# EAGLE design yamaguchi (EAGLE 7.4.0)
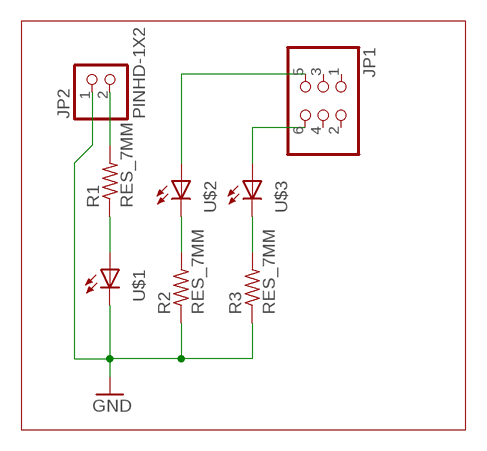
[diagram p0: schematic, sheet 1]

## Parts
JP1  PINHD-2X3  [2X03]
JP2  PINHD-1X2  [1X02]
R1  RES_7MM  [0204/7]
R2  RES_7MM  [0204/7]
R3  RES_7MM  [0204/7]
U$1  LED1206  [1206]
U$2  LED1206  [1206]
U$3  LED1206  [1206]

## Nets
GND: JP2.1 R2.1 R3.1 U$1.2(C)
N$1: JP2.2 R1.2
N$2: R1.1 U$1.1(A)
N$4: R2.2 U$2.2(C)
N$5: R3.2 U$3.2(C)
N$6: JP1.6 U$3.1(A)
N$7: JP1.5 U$2.1(A)
Unconnected: JP1.1 JP1.2 JP1.3 JP1.4

## Library data of the parts
JP1 = 01_EasyAccessLib:PINHD-2X3: PIN HEADER
JP2 = Yamaguchi:PINHD-1X2
R1-R3 = Yamaguchi:RES_7MM
U$1-U$3 = 01_EasyAccessLib:LED

## Board
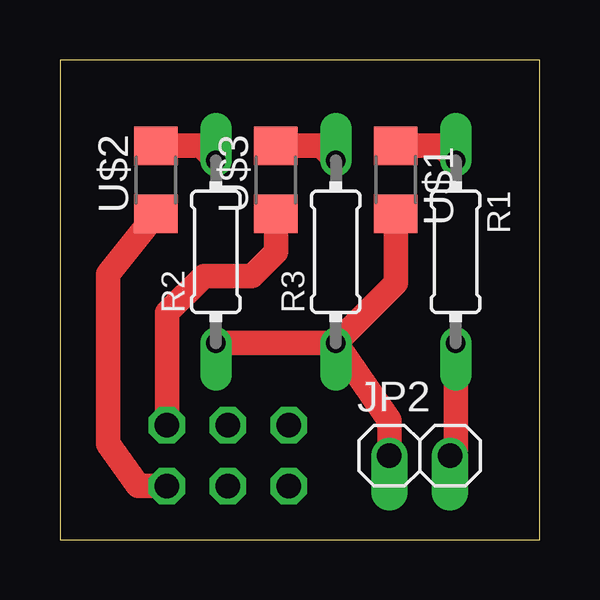
[diagram p1: board, top side]
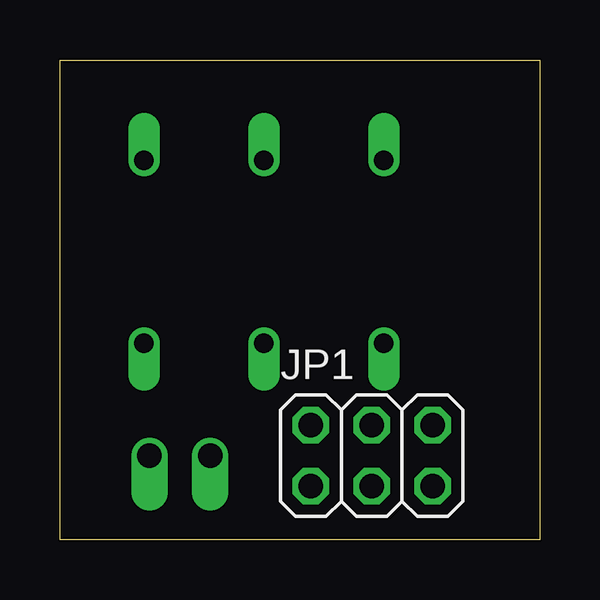
[diagram p2: board, bottom side, seen from below]

Size 20 x 20 mm. Coordinates in mm from the lower left corner, seen from the top.
Outline: 0,0 20,0 20,20 0,20 0,0
Copper layers (1*16): Top 0.035mm / dielectric 1.5mm / Bottom 0.035mm
Design rules "default *": minimum track width 10mil, minimum drill 24mil, track to track 0.4mm, track to pad 0.4mm, pad to pad 0.4mm, via to via 0.4mm, smd to smd 0.4mm, copper to edge 0.4mm, drill to drill 0.4mm, minimum pad ring 10mil, minimum via ring 8mil, stop-mask expansion 4mil, vias tented up to drill 0mil, thermal gap 10mil

### Footprints (pad centres in the part's own frame; a part is rotated, then mirrored left to right if it is on the bottom)
2X03 = drill 1.016 octagon: 1 -2.54,-1.27; 2 -2.54,1.27; 3 0,-1.27; 4 0,1.27; 5 2.54,-1.27; 6 2.54,1.27
1X02 = drill 1.016 offset: 1 -1.27,0; 2 1.27,0
0204/7 = drill 0.813 offset: 1 -3.81,0; 2 3.81,0
1206 = smd 1.6 x 1.803: 1 -1.422,0; 2 1.422,0

### Placement (x,y rotation side)
JP1  7,3.5 0 bottom
JP2  15,3.5 0 top
R1  16.5,12 270 top
R2  6.5,12 90 top
R3  11.5,12 90 top
U$1  14,15 270 top
U$2  4,15 90 top
U$3  9,15 90 top

### Tracks (layer width: path | path; a pad name or v marks a point on that pad's centre or on a via)
GND
  Top 1.016: R2.1 R3.1 | U$1.2 14,10.69 R3.1 | R3.1 13.73,4.96 JP2.1
N$1
  Top 1.016: R1.2 16.5,3.73 JP2.2
N$2
  Top 1.016: U$1.1 15.89,16.42 R1.1
N$4
  Top 1.016: U$2.2 5.89,16.42 R2.2
N$5
  Top 1.016: U$3.2 10.89,16.42 R3.2
N$6
  Top 0.406: 8.5,13.5 U$3.1
  Top 1.016: JP1.6 4.46,9.46 6,11 8,11 9,12 U$3.1
N$7
  Top 1.016: U$2.1 2,11.08 2,4 3.27,2.23 JP1.5